# Altium schematic sheet MIXR Processing - STM32F7 Microcontroller.SchDoc: Title
size B; Organization: Midnight Sun Solar Rayce Car Team; Address1: University of Waterloo; Address2: 200 University Ave W; Address3: Waterloo, ON, Canada; Address4: N2L 3E9; Website: www.uwmidsun.com; ProjectName: ProjectName
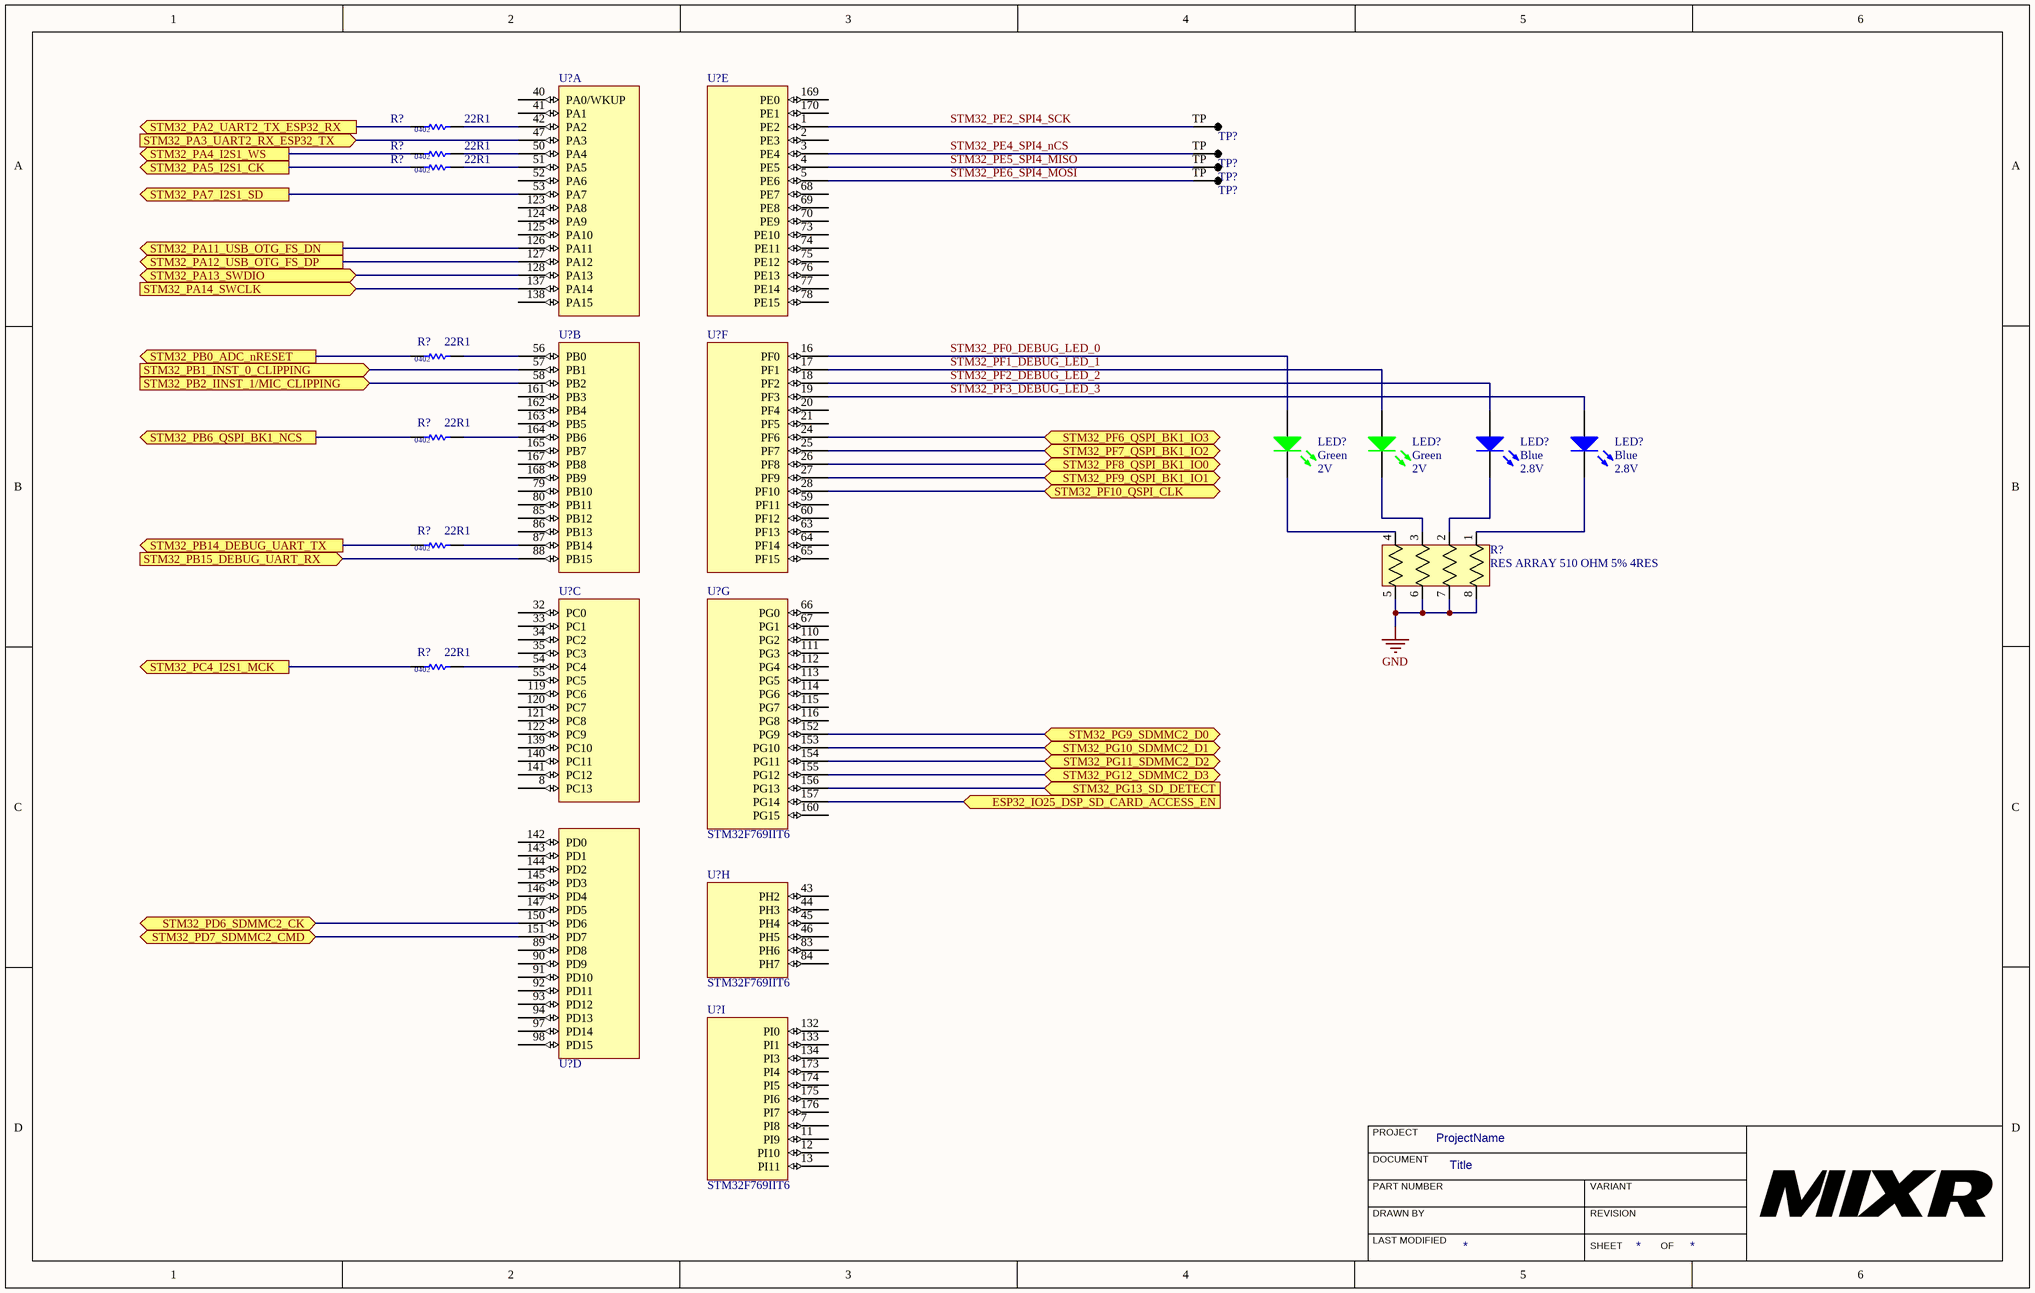
[diagram p0: MIXR Processing - STM32F7 Microcontroller.SchDoc]

## Parts
(Parts that share a designator on the sheet are numbered #1, #2 ... from top to bottom, then left to right.)
LED?#1  Color: Green  Voltage - Forward (Vf) (Typ): 2V  [LED_0603]  (hidden comment: LED GREEN CLEAR 2V 0603)
LED?#2  Color: Green  Voltage - Forward (Vf) (Typ): 2V  [LED_0603]  (hidden comment: LED GREEN CLEAR 2V 0603)
LED?#3  Color: Blue  Voltage - Forward (Vf) (Typ): 2.8V  [LED_0603]  (hidden comment: LED BLUE CLEAR 2.8V 0603)
LED?#4  Color: Blue  Voltage - Forward (Vf) (Typ): 2.8V  [LED_0603]  (hidden comment: LED BLUE CLEAR 2.8V 0603)
R?#1  Resistance: 22R1  [RES 0402]  (hidden comment: RES 22.1 OHM 1% 1/16W 0402)
R?#2  Resistance: 22R1  [RES 0402]  (hidden comment: RES 22.1 OHM 1% 1/16W 0402)
R?#3  Resistance: 22R1  [RES 0402]  (hidden comment: RES 22.1 OHM 1% 1/16W 0402)
R?#4  Resistance: 22R1  [RES 0402]  (hidden comment: RES 22.1 OHM 1% 1/16W 0402)
R?#5  Resistance: 22R1  [RES 0402]  (hidden comment: RES 22.1 OHM 1% 1/16W 0402)
R?#6  Resistance: 22R1  [RES 0402]  (hidden comment: RES 22.1 OHM 1% 1/16W 0402)
R?#7  RES ARRAY 510 OHM 5% 4RES  [RES ARRAY 4 POS 0804]
R?#8  Resistance: 22R1  [RES 0402]  (hidden comment: RES 22.1 OHM 1% 1/16W 0402)
TP?#1  Test Point  [Test Point]  (value not drawn)  (no BOM)
TP?#2  Test Point  [Test Point]  (value not drawn)  (no BOM)
TP?#3  Test Point  [Test Point]  (value not drawn)  (no BOM)
TP?#4  Test Point  [Test Point]  (value not drawn)  (no BOM)
U?#1  IC MCU STM32F769II 176-LQFP  [TSQFP50P2600X2600X160-176M]  (value not drawn)  (part A of 11)
U?#2  IC MCU STM32F769II 176-LQFP  [TSQFP50P2600X2600X160-176M]  (value not drawn)  (part E of 11)
U?#3  IC MCU STM32F769II 176-LQFP  [TSQFP50P2600X2600X160-176M]  (value not drawn)  (part B of 11)
U?#4  IC MCU STM32F769II 176-LQFP  [TSQFP50P2600X2600X160-176M]  (value not drawn)  (part F of 11)
U?#5  IC MCU STM32F769II 176-LQFP  [TSQFP50P2600X2600X160-176M]  (value not drawn)  (part C of 11)
U?#6  Manufacturer Part Number: STM32F769IIT6  [TSQFP50P2600X2600X160-176M]  (hidden comment: IC MCU STM32F769II 176-LQFP)  (part G of 11)
U?#7  IC MCU STM32F769II 176-LQFP  [TSQFP50P2600X2600X160-176M]  (value not drawn)  (part D of 11)
U?#8  Manufacturer Part Number: STM32F769IIT6  [TSQFP50P2600X2600X160-176M]  (hidden comment: IC MCU STM32F769II 176-LQFP)  (part H of 11)
U?#9  Manufacturer Part Number: STM32F769IIT6  [TSQFP50P2600X2600X160-176M]  (hidden comment: IC MCU STM32F769II 176-LQFP)  (part I of 11)

## Ports
ESP32_IO25_DSP_SD_CARD_ACCESS_EN (in), STM32_PA2_UART2_TX_ESP32_RX (out), STM32_PA3_UART2_RX_ESP32_TX (in), STM32_PA4_I2S1_WS (out), STM32_PA5_I2S1_CK (out), STM32_PA7_I2S1_SD (out), STM32_PA11_USB_OTG_FS_DN (out), STM32_PA12_USB_OTG_FS_DP (out), STM32_PA13_SWDIO (bidir), STM32_PA14_SWCLK (in), STM32_PB0_ADC_nRESET (out), STM32_PB1_INST_0_CLIPPING (in), STM32_PB2_IINST_1/MIC_CLIPPING (in), STM32_PB6_QSPI_BK1_NCS (out), STM32_PB14_DEBUG_UART_TX (out), STM32_PB15_DEBUG_UART_RX (in), STM32_PC4_I2S1_MCK (out), STM32_PD6_SDMMC2_CK (bidir), STM32_PD7_SDMMC2_CMD (bidir), STM32_PF6_QSPI_BK1_IO3 (bidir), STM32_PF7_QSPI_BK1_IO2 (bidir), STM32_PF8_QSPI_BK1_IO0 (bidir), STM32_PF9_QSPI_BK1_IO1 (bidir), STM32_PF10_QSPI_CLK (bidir), STM32_PG9_SDMMC2_D0 (bidir), STM32_PG10_SDMMC2_D1 (bidir), STM32_PG11_SDMMC2_D2 (bidir), STM32_PG12_SDMMC2_D3 (bidir), STM32_PG13_SD_DETECT (in)

## Nets
GND: R?#7.5 R?#7.6 R?#7.7 R?#7.8
ESP32_IO25_DSP_SD_CARD_ACCESS_EN: U?#6.157(PG14) ; port ESP32_IO25_DSP_SD_CARD_ACCESS_EN
STM32_PA2_UART2_TX_ESP32_RX: R?#1.1 ; port STM32_PA2_UART2_TX_ESP32_RX
STM32_PA3_UART2_RX_ESP32_TX: U?#1.47(PA3) ; port STM32_PA3_UART2_RX_ESP32_TX
STM32_PA4_I2S1_WS: R?#2.1 ; port STM32_PA4_I2S1_WS
STM32_PA5_I2S1_CK: R?#3.1 ; port STM32_PA5_I2S1_CK
STM32_PA7_I2S1_SD: U?#1.53(PA7) ; port STM32_PA7_I2S1_SD
STM32_PA11_USB_OTG_FS_DN: U?#1.126(PA11) ; port STM32_PA11_USB_OTG_FS_DN
STM32_PA12_USB_OTG_FS_DP: U?#1.127(PA12) ; port STM32_PA12_USB_OTG_FS_DP
STM32_PA13_SWDIO: U?#1.128(PA13) ; port STM32_PA13_SWDIO
STM32_PA14_SWCLK: U?#1.137(PA14) ; port STM32_PA14_SWCLK
STM32_PB0_ADC_nRESET: R?#4.1 ; port STM32_PB0_ADC_nRESET
STM32_PB1_INST_0_CLIPPING: U?#3.57(PB1) ; port STM32_PB1_INST_0_CLIPPING
STM32_PB2_IINST_1/MIC_CLIPPING: U?#3.58(PB2) ; port STM32_PB2_IINST_1/MIC_CLIPPING
STM32_PB6_QSPI_BK1_NCS: R?#5.1 ; port STM32_PB6_QSPI_BK1_NCS
STM32_PB14_DEBUG_UART_TX: R?#6.1 ; port STM32_PB14_DEBUG_UART_TX
STM32_PB15_DEBUG_UART_RX: U?#3.88(PB15) ; port STM32_PB15_DEBUG_UART_RX
STM32_PC4_I2S1_MCK: R?#8.1 ; port STM32_PC4_I2S1_MCK
STM32_PD6_SDMMC2_CK: U?#7.150(PD6) ; port STM32_PD6_SDMMC2_CK
STM32_PD7_SDMMC2_CMD: U?#7.151(PD7) ; port STM32_PD7_SDMMC2_CMD
STM32_PE2_SPI4_SCK: TP?#1.TP U?#2.1(PE2)
STM32_PE4_SPI4_nCS: TP?#2.TP U?#2.3(PE4)
STM32_PE5_SPI4_MISO: TP?#3.TP U?#2.4(PE5)
STM32_PE6_SPI4_MOSI: TP?#4.TP U?#2.5(PE6)
STM32_PF0_DEBUG_LED_0: LED?#1.1(A) U?#4.16(PF0)
STM32_PF1_DEBUG_LED_1: LED?#2.1(A) U?#4.17(PF1)
STM32_PF2_DEBUG_LED_2: LED?#3.1(A) U?#4.18(PF2)
STM32_PF3_DEBUG_LED_3: LED?#4.1(A) U?#4.19(PF3)
STM32_PF6_QSPI_BK1_IO3: U?#4.24(PF6) ; port STM32_PF6_QSPI_BK1_IO3
STM32_PF7_QSPI_BK1_IO2: U?#4.25(PF7) ; port STM32_PF7_QSPI_BK1_IO2
STM32_PF8_QSPI_BK1_IO0: U?#4.26(PF8) ; port STM32_PF8_QSPI_BK1_IO0
STM32_PF9_QSPI_BK1_IO1: U?#4.27(PF9) ; port STM32_PF9_QSPI_BK1_IO1
STM32_PF10_QSPI_CLK: U?#4.28(PF10) ; port STM32_PF10_QSPI_CLK
STM32_PG9_SDMMC2_D0: U?#6.152(PG9) ; port STM32_PG9_SDMMC2_D0
STM32_PG10_SDMMC2_D1: U?#6.153(PG10) ; port STM32_PG10_SDMMC2_D1
STM32_PG11_SDMMC2_D2: U?#6.154(PG11) ; port STM32_PG11_SDMMC2_D2
STM32_PG12_SDMMC2_D3: U?#6.155(PG12) ; port STM32_PG12_SDMMC2_D3
STM32_PG13_SD_DETECT: U?#6.156(PG13) ; port STM32_PG13_SD_DETECT
NetLED?#1_2: LED?#1.2(K) R?#7.4
NetLED?#2_2: LED?#2.2(K) R?#7.3
NetLED?#3_2: LED?#3.2(K) R?#7.2
NetLED?#4_2: LED?#4.2(K) R?#7.1
NetR?#1_2: R?#1.2 U?#1.42(PA2)
NetR?#2_2: R?#2.2 U?#1.50(PA4)
NetR?#3_2: R?#3.2 U?#1.51(PA5)
NetR?#4_2: R?#4.2 U?#3.56(PB0)
NetR?#5_2: R?#5.2 U?#3.164(PB6)
NetR?#6_2: R?#6.2 U?#3.87(PB14)
NetR?#8_2: R?#8.2 U?#5.54(PC4)

Not connected (* = marked no-connect by the designer): U?#1 40(PA0/WKUP) 41(PA1) 52(PA6) 123(PA8) 124(PA9) 125(PA10) 138(PA15); U?#2 2(PE3) 68(PE7) 69(PE8) 70(PE9) 73(PE10) 74(PE11) 75(PE12) 76(PE13) 77(PE14) 78(PE15) 169(PE0) 170(PE1); U?#3 79(PB10) 80(PB11) 85(PB12) 86(PB13) 161(PB3) 162(PB4) 163(PB5) 165(PB7) 167(PB8) 168(PB9); U?#4 20(PF4) 21(PF5) 59(PF11) 60(PF12) 63(PF13) 64(PF14) 65(PF15); U?#5 8(PC13) 32(PC0) 33(PC1) 34(PC2) 35(PC3) 55(PC5) 119(PC6) 120(PC7) 121(PC8) 122(PC9) 139(PC10) 140(PC11) 141(PC12); U?#6 66(PG0) 67(PG1) 110(PG2) 111(PG3) 112(PG4) 113(PG5) 114(PG6) 115(PG7) 116(PG8) 160(PG15); U?#7 89(PD8) 90(PD9) 91(PD10) 92(PD11) 93(PD12) 94(PD13) 97(PD14) 98(PD15) 142(PD0) 143(PD1) 144(PD2) 145(PD3) 146(PD4) 147(PD5); U?#8 43(PH2) 44(PH3) 45(PH4) 46(PH5) 83(PH6) 84(PH7); U?#9 7(PI8) 11(PI9) 12(PI10) 13(PI11) 132(PI0) 133(PI1) 134(PI3) 173(PI4) 174(PI5) 175(PI6) 176(PI7)

## Notes on the sheet
- PROJECT
- DOCUMENT
- DRAWN BY
- LAST MODIFIED
- PART NUMBER
- REVISION
- SHEET
- VARIANT
- OF

## Library data of the parts
LED?#1 LED?#2 = LED GREEN CLEAR 2V 0603: Green 572nm LED Indication - Discrete 2V 0603 (1608 Metric); Manufacturer: Wurth Electronics Inc.; Manufacturer Part Number: 150060VS75000; Lens Color: Colorless; Millicandela Rating: 40mcd; Lens Style/Size: Rectangle with Flat Top, 1.10mm x 0.70mm; Current - Test: 20mA; Viewing Angle: 140°; Wavelength - Dominant: 570nm; Supplier 1: Digi-Key; RoHS: RoHS Compliant; Category: Optoelectronics; Stock 1: 9408; Pricing 1: 1=0.21, 100=0.1617, 500=0.13964 (CAD); Packaging: Cut Tape (CT); Part Status: Active; Lens Transparency: Clear; Mounting Type: Surface Mount; Wavelength - Peak: 572nm; Features: -; Package / Case: 0603 (1608 Metric); Supplier Device Package: 0603; Size / Dimension: 1.60mm L x 0.80mm W; Height (Max): 0.80mm; ComponentLink1URL: http://katalog.we-online.de/led/datasheet/150060VS75000.pdf; ComponentLink1Description: http://katalog.we-online.de/led/datasheet/150060VS75000.pdf; Supplier Part Number 1: 732-4980-1-ND
LED?#3 LED?#4 = LED BLUE CLEAR 2.8V 0603: Blue 470nm LED Indication - Discrete 2.8V 0603 (1608 Metric); Manufacturer 1: Lite-On Inc.; Manufacturer Part Number 1: LTST-C193TBKT-5A; Lens Color: Colorless; Millicandela Rating: 15mcd; Lens Style/Size: Rectangle with Flat Top, 1.15mm x 0.80mm; Current - Test: 5mA; Viewing Angle: 130°; Wavelength - Peak: 468nm; Supplier 1: Digi-Key; Supplier Part Number 1: 160-1827-1-ND; Packaging: Cut Tape (CT); Part Status: Active; Lens Transparency: Clear; Mounting Type: Surface Mount; Wavelength - Dominant: 470nm; Package / Case: 0603 (1608 Metric); Supplier Device Package: Chip LED; Size / Dimension: 1.60mm L x 0.80mm W; Height (Max): 0.45mm; ComponentLink1URL: http://optoelectronics.liteon.com/upload/download/DS22-2004-060/P_100_LTST-C193TBKT-5A.pdf; ComponentLink1Description: http://optoelectronics.liteon.com/upload/download/DS22-2004-060/P_100_LTST-C193TBKT-5A.pdf
R?#1-R?#6 R?#8 = RES 22.1 OHM 1% 1/16W 0402: RES SMD 22.1 OHM 1% 1/16W 0402; Manufacturer: Yageo; Manufacturer Part Number: RC0402FR-0722R1L; Temperature Coefficient: 100ppm/°C; Power Rating: 62.5mW; Voltage Rating: 50V; Max Power Dissipation: 63mW; Supplier 1: Digi-Key; Supplier Part Number 1: 311-22.1LRCT-ND; Packaging: Tape and Reel; Composition: Thick Film; ComponentLink1URL: https://datasheet.ciiva.com/11808/0900766b80c66297-11808453.pdf?src-supplier=RSComponents; ComponentLink1Description: https://datasheet.ciiva.com/11808/0900766b80c66297-11808453.pdf?src-supplier=RSComponents; Tolerance: 1%; RoHS: Yes; Category: Chip SMD Resistors; Stock 1: 5073010; Pricing 1: 1=0.10000, 10=0.01600, 100=0.00640, 1000=0.00289, 2500=0.00251, 5000=0.00207 (USD); Case/Package: 0402; Case Code (Imperial): 0402; Case Code (Metric): 1005; Min Operating Temperature: -55°C; Max Operating Temperature: 155°C; Package Quantity: 1; Termination: SMD/SMT; Number of Terminations: 2; Military Standard: Not; Features: Moisture Resistant; Voltage Rating (DC): 50V; Working Voltage: 50V; Length: 1mm; Height: 0.016inch; Width: 0.02inch; Depth: 0.5mm; Lead Free: Lead Free; REACH SVHC: No SVHC; ComponentLink2URL: https://datasheet.ciiva.com/16740/pyu-rc0402-51-rohs-l-6-r-16740855.pdf?src-supplier=Future+Electronics; ComponentLink2Description: https://datasheet.ciiva.com/16740/pyu-rc0402-51-rohs-l-6-r-16740855.pdf?src-supplier=Future+Electronics; ComponentLink3URL: https://datasheet.ciiva.com/2518/pyu-r-int-thick-7-2518970.pdf?src-supplier=Digi-Key; ComponentLink3Description: https://datasheet.ciiva.com/2518/pyu-r-int-thick-7-2518970.pdf?src-supplier=Digi-Key; ComponentLink4URL: https://datasheet.ciiva.com/2518/pyu-r-int-thick-7-2518971.pdf?src-supplier=Digi-Key; ComponentLink4Description: https://datasheet.ciiva.com/2518/pyu-r-int-thick-7-2518971.pdf?src-supplier=Digi-Key; ComponentLink5URL: https://datasheet.ciiva.com/2518/pyu-r-int-thick-7-2518972.pdf?src-supplier=Digi-Key; ComponentLink5Description: https://datasheet.ciiva.com/2518/pyu-r-int-thick-7-2518972.pdf?src-supplier=Digi-Key
R?#7 = RES ARRAY 510 OHM 5% 4RES EXB-N8V511JX: RES ARRAY SMD 510 OHM 5% 4RES EXB-N8V511JX; Manufacturer: Panasonic Electronic Components; Circuit Type: Isolated; Resistance (Ohms): 510; Power Per Element: 31mW; Temperature Coefficient: ±200ppm/°C; Supplier 1: Digi-Key; Manufacturer Part Number: EXB-N8V511JX; RoHS: RoHS Compliant; Category: Resistors; Stock 1: 25621; Packaging: Cut Tape (CT); Part Status: Active; Tolerance: ±5%; Operating Temperature: -55°C ~ 125°C; Applications: -; Mounting Type: Surface Mount; Package / Case: 0804, Concave, Long Side Terminals; Supplier Device Package: 0804; Size / Dimension: 0.079" L x 0.039" W (2.00mm x 1.00mm); Height - Seated (Max): 0.022" (0.55mm); ComponentLink1URL: https://industrial.panasonic.com/cdbs/www-data/pdf/AOC0000/AOC0000C14.pdf; ComponentLink1Description: https://industrial.panasonic.com/cdbs/www-data/pdf/AOC0000/AOC0000C14.pdf; Supplier Part Number 1: Y10511CT-ND; Pricing 1: 1=0.15, 10=0.101, 25=0.0696, 50=0.0544, 100=0.0389, 250=0.03024, 500=0.02404, 1000=0.01706, 5000=0.01319 (CAD)
U?#1-U?#5 U?#7 = IC MCU STM32F769II 176-LQFP: ARM® Cortex®-M7 STM32F7 Microcontroller IC 32-Bit 216MHz 2MB (2M x 8) FLASH 176-LQFP (24x24); Manufacturer: STMicroelectronics; Manufacturer Part Number: STM32F769IIT6; Description: IC MCU 32BIT 2MB FLASH 176LQFP; Supplier 1: Digi-Key; RoHS: No; Category: Microcontrollers; Stock 1: 295; Pricing 1: 1=12.69000, 10=11.66300, 25=11.18000, 100=9.85040, 250=9.36696, 500=8.76264, 1000=8.03746 (USD); ComponentLink1URL: http://www.st.com/content/ccc/resource/technical/document/errata_sheet/group0/23/a6/11/0b/30/24/46/a5/DM00257543/files/DM00257543.pdf/jcr:content/translations/en.DM00257543.pdf?src-supplier=Digi-Key; ComponentLink1Description: http://www.st.com/content/ccc/resource/technical/document/errata_sheet/group0/23/a6/11/0b/30/24/46/a5/DM00257543/files/DM00257543.pdf/jcr:content/translations/en.DM00257543.pdf?src-supplier=Digi-Key; Supplier Part Number 1: 497-16649-ND
U?#6 U?#8 U?#9 = IC MCU STM32F769II 176-LQFP: ARM® Cortex®-M7 STM32F7 Microcontroller IC 32-Bit 216MHz 2MB (2M x 8) FLASH 176-LQFP (24x24); Manufacturer: STMicroelectronics; Description: IC MCU 32BIT 2MB FLASH 176LQFP; Supplier 1: Digi-Key; RoHS: No; Category: Microcontrollers; Stock 1: 295; Pricing 1: 1=12.69000, 10=11.66300, 25=11.18000, 100=9.85040, 250=9.36696, 500=8.76264, 1000=8.03746 (USD); ComponentLink1URL: http://www.st.com/content/ccc/resource/technical/document/errata_sheet/group0/23/a6/11/0b/30/24/46/a5/DM00257543/files/DM00257543.pdf/jcr:content/translations/en.DM00257543.pdf?src-supplier=Digi-Key; ComponentLink1Description: http://www.st.com/content/ccc/resource/technical/document/errata_sheet/group0/23/a6/11/0b/30/24/46/a5/DM00257543/files/DM00257543.pdf/jcr:content/translations/en.DM00257543.pdf?src-supplier=Digi-Key; Supplier Part Number 1: 497-16649-ND